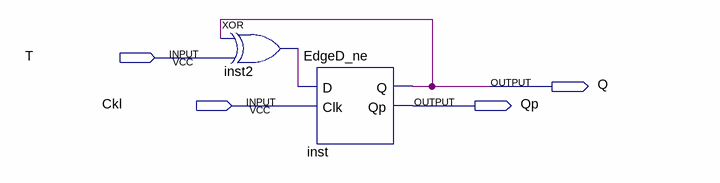
[diagram p0: schematic sheet]
// Quartus schematic T_D.bdf as structural Verilog: 2 symbols, 4 pins
module T_D (
  input  T,
  input  Ckl,
  output Q,
  output Qp
);

  wire inst2_out;

  xor inst2 (inst2_out, Q, T);
  EdgeD_ne inst (.D(inst2_out), .Clk(Ckl), .Q(Q), .Qp(Qp));
endmodule
